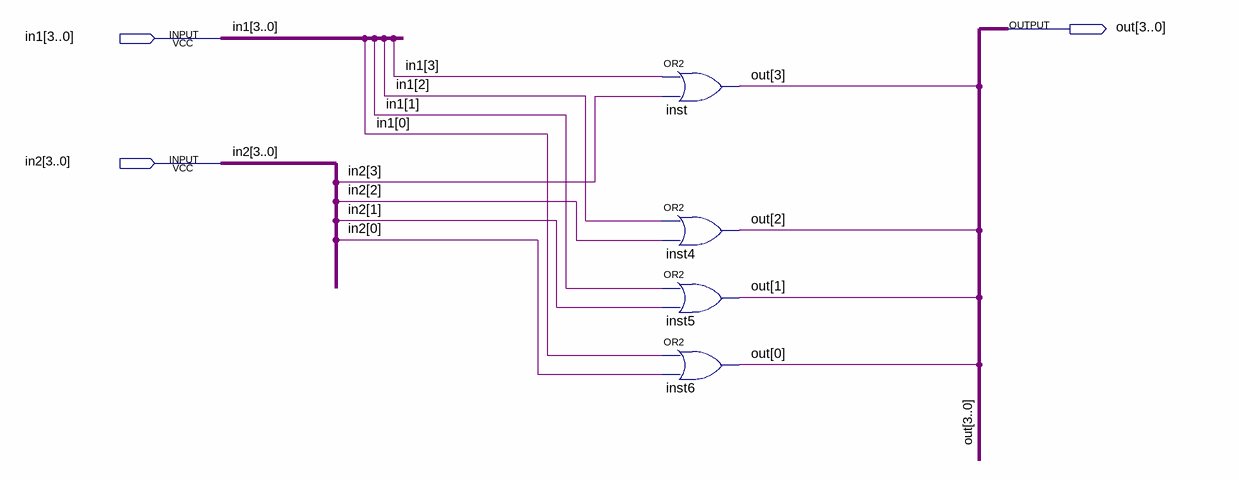
[diagram p0: schematic sheet]
// Quartus schematic or4bit.bdf as structural Verilog: 4 symbols, 3 pins
module or4bit (
  input  [3:0] in1,
  input  [3:0] in2,
  output [3:0] out
);

  or inst (out[3], in1[3], in2[3]);
  or inst4 (out[2], in1[2], in2[2]);
  or inst5 (out[1], in1[1], in2[1]);
  or inst6 (out[0], in1[0], in2[0]);
endmodule
